# EasyEDA schematic Pressure Sensor2.json

## Sheets
1 Sheet_2: TITLE: Top Layer, Packing Machine; REV: 1.0; Date: 2022-11-06; Sheet: 1/1; Drawn By: RDickens; Company: Roy Dickens
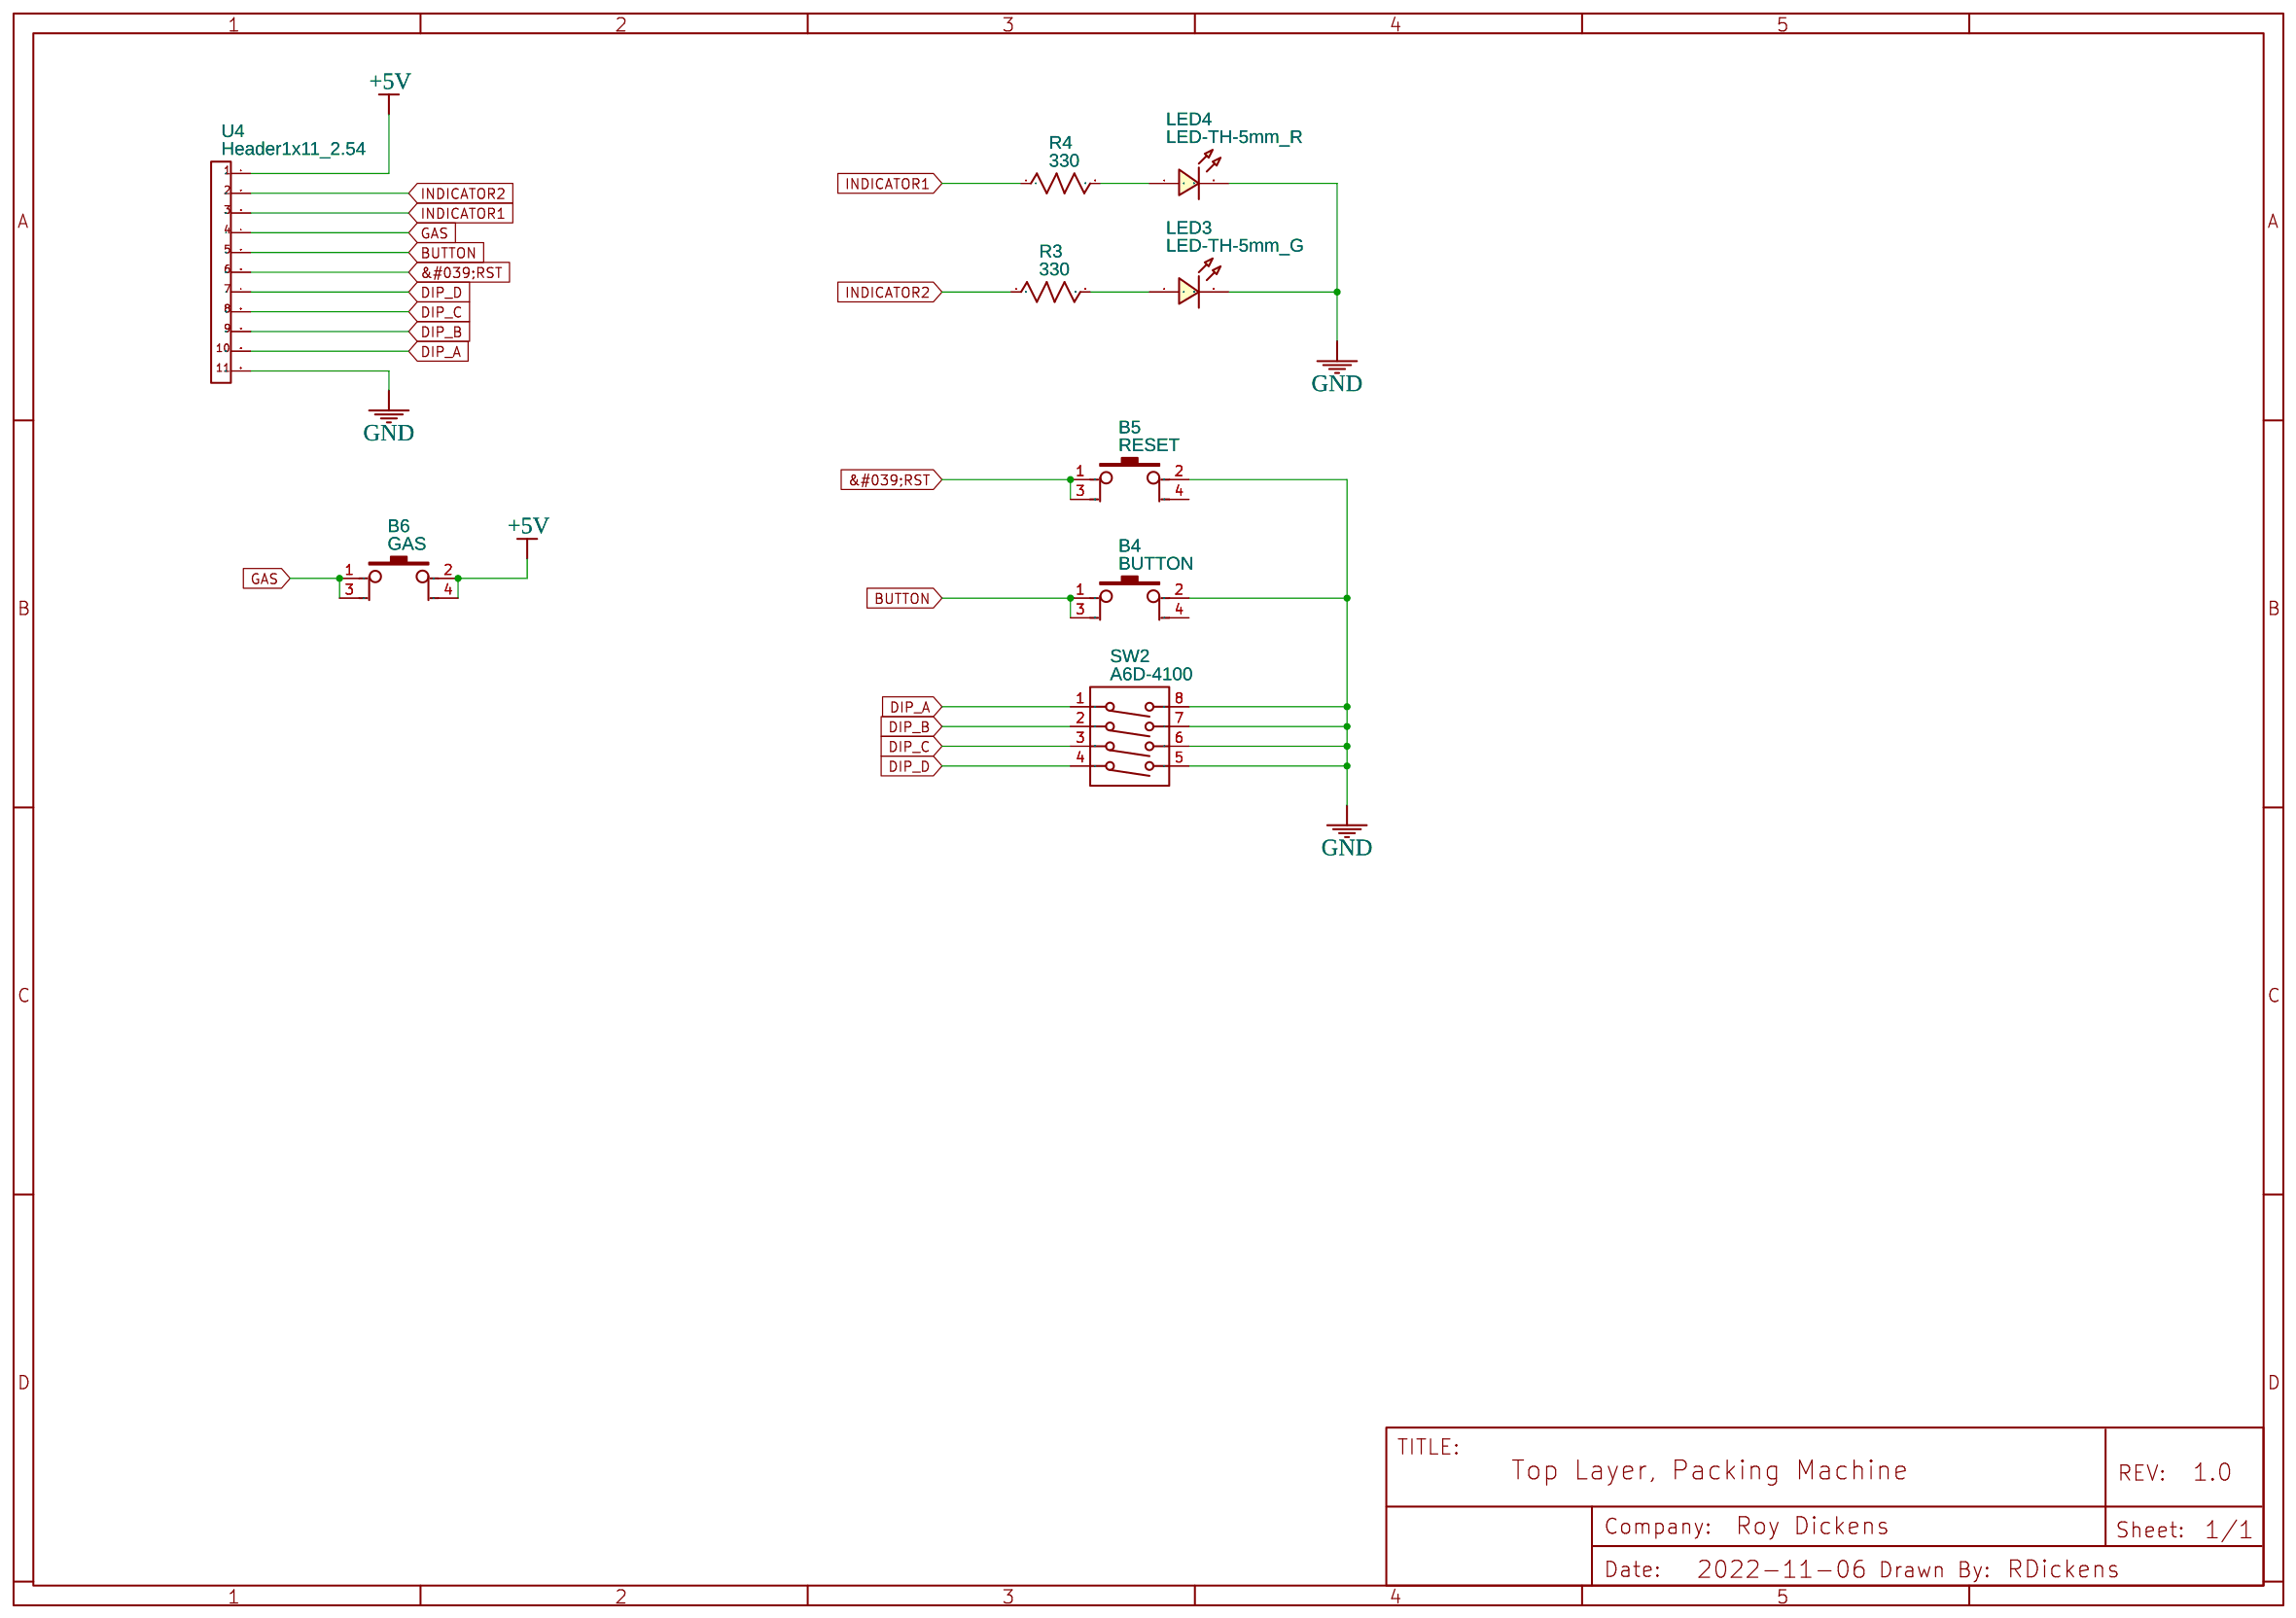
[diagram p0: Sheet_2]
2 Sheet_3: TITLE: Middle Layer, Packing Machine
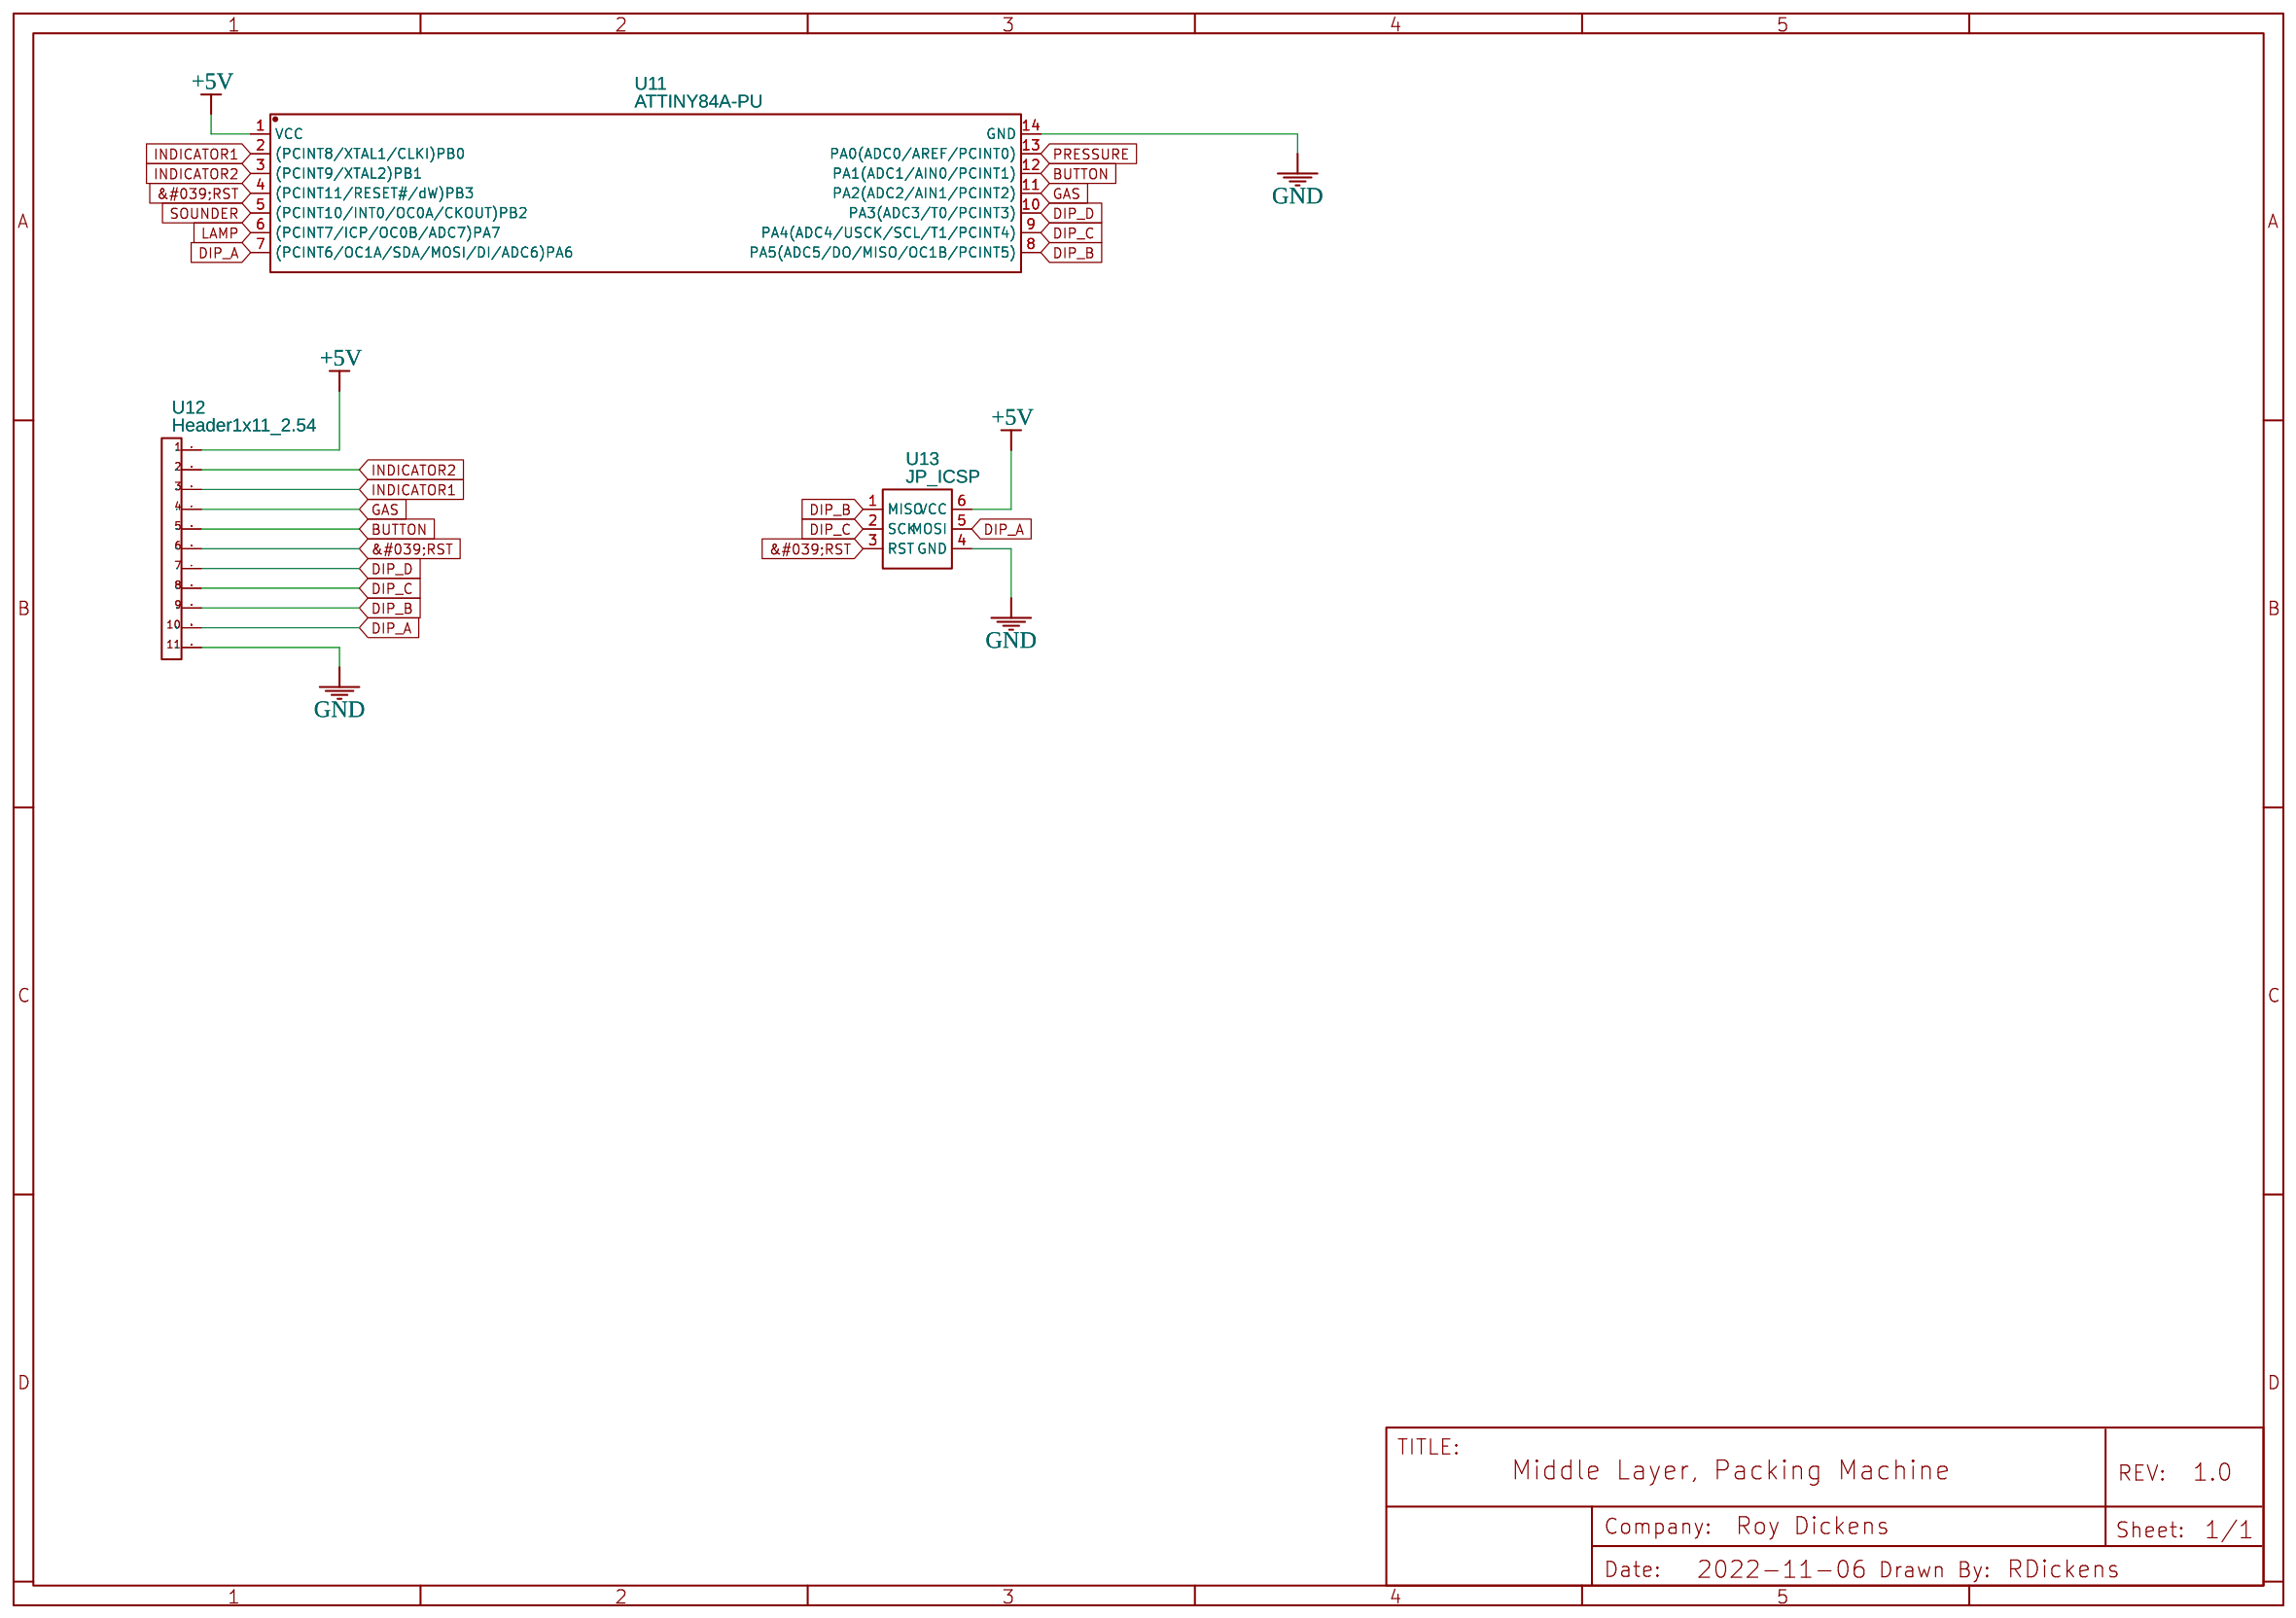
[diagram p1: Sheet_3]
3 Sheet_4: TITLE: Bottom Layer, Packing Machine
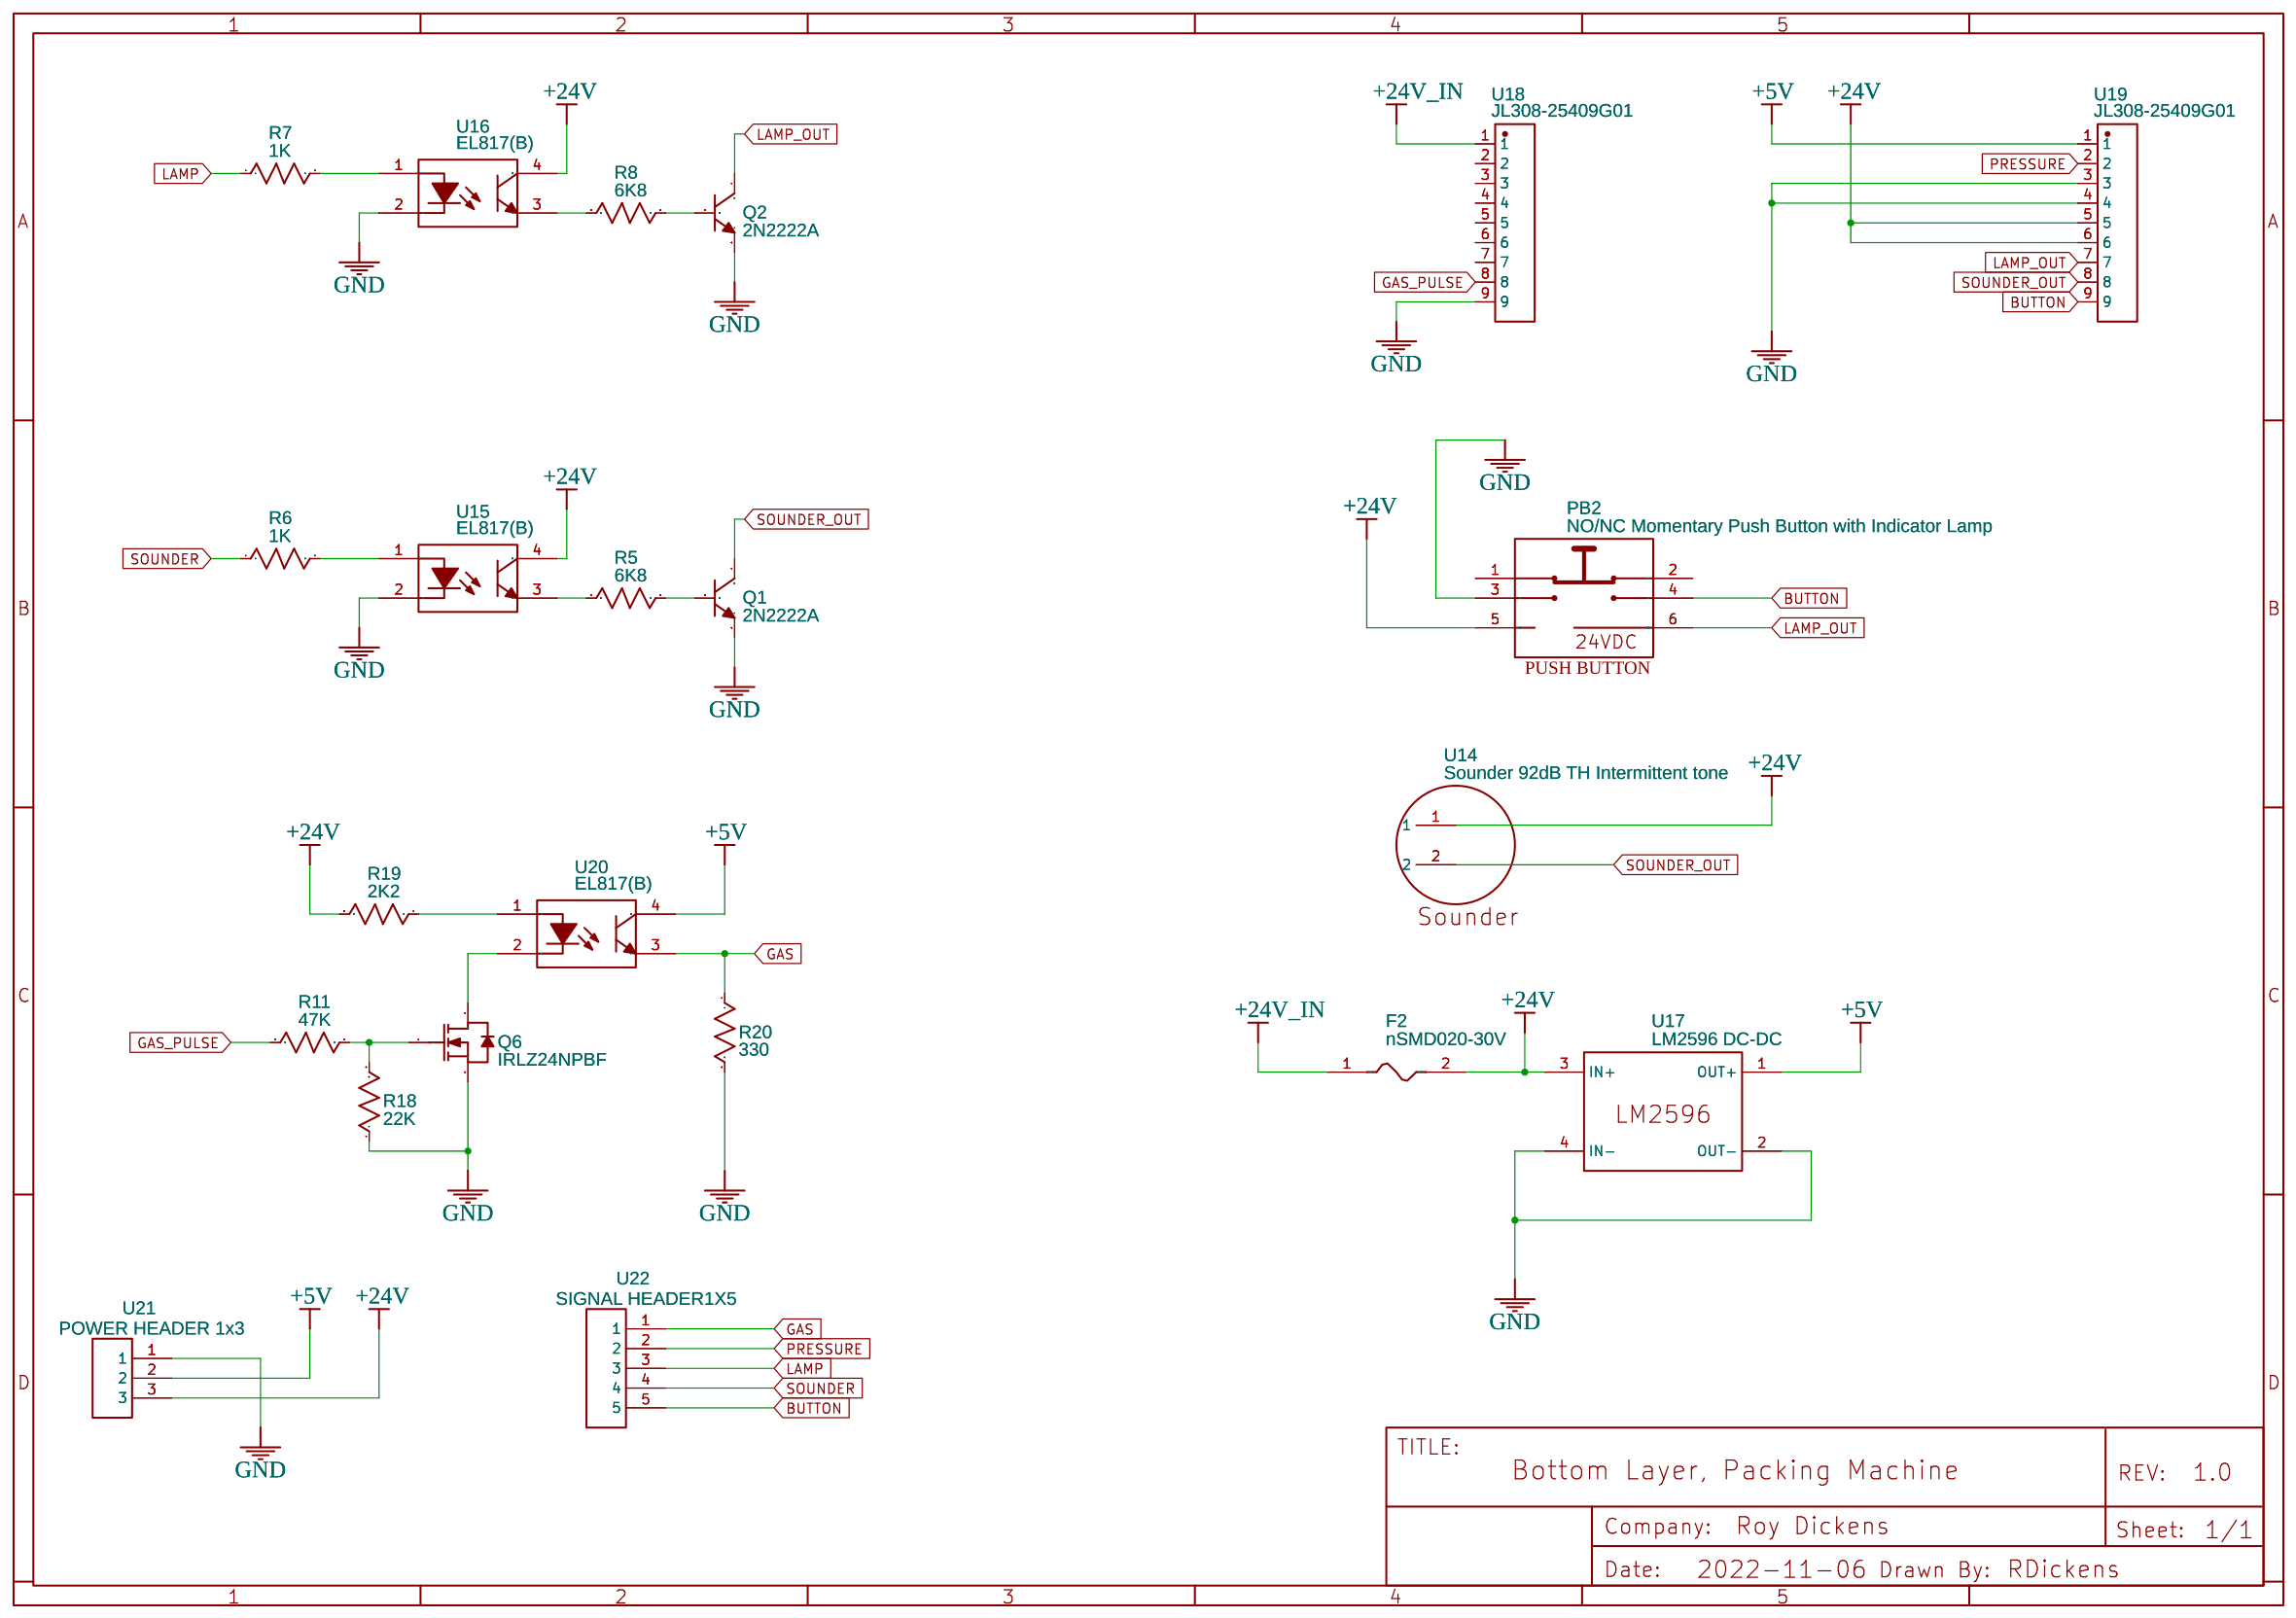
[diagram p2: Sheet_4]

## Parts
sheet Sheet_2
B4  BUTTON  [PUSHBUTTON]
B5  RESET  [PUSHBUTTON]
B6  GAS  [PUSHBUTTON]
LED3  LED-TH-5mm_G  [LED-TH_BD5.0_RED]
LED4  LED-TH-5mm_R  [LED-TH_BD5.0_RED]
R3  330  [R0603]
R4  330  [R0603]
SW2  A6D-4100  [SW-TH_8P-L12.2-W6.6-P2.54-LS7.62-BL]
U4  Header1x11_2.54  [HEADER1X11_2.54]
sheet Sheet_3
U11  ATTINY84A-PU  [DIP-14_L19.2-W6.6-P2.54-LS10.9-BL]
U12  Header1x11_2.54  [HEADER1X11_2.54]
U13  JP_ICSP  [JP_ICSP]
sheet Sheet_4
F2  nSMD020-30V  [F1206]
PB2  NO/NC Momentary Push Button with Indicator Lamp
Q1  2N2222A  [TO-92-3_L4.8-W3.7-P2.54-R]
Q2  2N2222A  [TO-92-3_L4.8-W3.7-P2.54-R]
Q6  IRLZ24NPBF  [TO-220-3_L10.0-W4.5-P2.54-T]
R5  6K8  [R0603]
R6  1K  [R0603]
R7  1K  [R0603]
R8  6K8  [R0603]
R11  47K  [R0603]
R18  22K  [R0603]
R19  2K2  [R0603]
R20  330  [R0603]
U14  Sounder 92dB TH Intermittent tone
U15  EL817(B)  [DIP-4_L6.5-W4.6-P2.54-LS7.6-BL]
U16  EL817(B)  [DIP-4_L6.5-W4.6-P2.54-LS7.6-BL]
U17  LM2596 DC-DC  [LM2596]
U18  JL308-25409G01  [CONN-TH_9P-P2.54_JILN_JL308-25409G01]
U19  JL308-25409G01  [CONN-TH_9P-P2.54_JILN_JL308-25409G01]
U20  EL817(B)  [DIP-4_L6.5-W4.6-P2.54-LS7.6-BL]
U21  POWER HEADER 1x3  [PINHEADER1X3]
U22  SIGNAL HEADER1X5  [PINHEADER1X5N]

## Library data of the parts
B4-B6 = PUSHBUTTON: Manufacturer Part: K2-1109DF-F4SW-04; Contributor: NC North; Supplier Part: C2909685; Supplier: LCSC; Manufacturer: 韩国韩荣
LED3 LED4 = LED-TH-5mm_R: Manufacturer: EVERLIGHT(台湾亿光); Manufacturer Part: 333-2SURD/S530-A3; Supplier Part: C87271; Supplier: LCSC; Contributor: LCEDA_Lib
R3 R4 = R_0603_US: Supplier Part: C713986; Supplier: LCSC; Contributor: LCEDA_Lib; Manufacturer Part: MF1/4W-330Ω±1%T52; Manufacturer: Huaxing Mechanical-Elec.
SW2 = A6D-4100: Supplier: LCSC; Supplier Part: C3313543; Manufacturer: OMRON(欧姆龙); link: https://atta.szlcsc.comnull; Contributor: lcsc
U4 U12 = Header1x11_2.54: Contributor: yabb777
U11 = ATTINY84A-PU: Supplier: LCSC; Manufacturer: MICROCHIP; Contributor: LCSC; Supplier Part: C145560; JLCPCB Part Class: Extended Part
U13 = JP_ICSP: Manufacturer: JILN; Manufacturer Part: 321006SG0ABK00A01; Supplier Part: C601936; Supplier: LCSC; Contributor: geotom
F2 = nSMD020-30V: Supplier: LCSC; Manufacturer: TECHFUSE; Supplier Part: C69680; JLCPCB Part Class: Extended Part
PB2 = NO/NC Momentary Push Button with Indicator Lamp: Manufacturer: Allied Electronics; Contributor: pretender42
Q1 Q2 = 2N2222A: Supplier: LCSC; Supplier Part: C358533; Manufacturer: Foshan Blue Rocket Elec; Contributor: LCSC; JLCPCB Part Class: Extended Part
Q6 = IRLZ24NPBF: Supplier: LCSC; Manufacturer: IR; Supplier Part: C11733; JLCPCB Part Class: Extended Part
R5-R8 R20 = R_0603_US: Supplier Part: C119314; Supplier: LCSC; Contributor: LCEDA_Lib; Manufacturer: Chian Chia Elec
R11 R18 = R_0603_US: Supplier Part: C714023; Supplier: LCSC; Contributor: LCEDA_Lib; Manufacturer Part: MF1/4W-24KΩ±1%T52; Manufacturer: Huaxing Mechanical-Elec.
R19 = R_0603_US: Supplier Part: C714002; Supplier: LCSC; Contributor: LCEDA_Lib; Manufacturer Part: MF1/4W-2.2KΩ±1%T52; Manufacturer: Huaxing Mechanical-Elec.
U14 = Sounder 92dB TH Intermittent tone: Manufacturer: Sonitron; Supplier: RS-Online; Supplier Part: 172-7560; Contributor: Coullboy
U15 U16 U20 = EL817(B): Supplier: LCSC; Supplier Part: C4749156; Manufacturer: EVERLIGHT(台湾亿光); Contributor: lcsc
U17 = LM2596 DC-DC: Contributor: allvex
U18 U19 = JL308-25409G01: Supplier: LCSC; Supplier Part: C99418; Manufacturer: Dongguan Guangzhu Industrial; Contributor: LCSC
U21 = PINHEADER1X3: Manufacturer Part: Pin_Header_2; Contributor: Wetronics
U22 = PINHEADER1X5: Supplier Part: undefined; Contributor: kbrunton

## Nets
+5V: B6.2(3) B6.4 U4.1 U11.1(VCC) U12.1 U13.6(VCC) U17.1(OUT+) U19.1 U20.4(C) U21.2
+24V: F2.2 PB2.5(LED) R19.2 U14.1 U15.4(C) U16.4(C) U17.3(IN+) U19.5 U19.6 U21.3
+24V_IN: F2.1 U18.1
GND: B4.2(3) B5.2(3) LED3.2 LED4.2 PB2.3(NO) Q1.3(E) Q2.3(E) Q6.3(S) R18.1 R20.2 SW2.5 SW2.6 SW2.7 SW2.8 U4.11 U11.14(GND) U12.11 U13.4(GND) U15.2(C) U16.2(C) U17.2(OUT-) U17.4(IN-) U18.9 U19.3 U19.4 U21.1
&#039;RST: B5.1 B5.3 U4.6 U11.4((PCINT11/RESET#/dW)PB3) U12.6 U13.3(RST)
BUTTON: B4.1 B4.3 PB2.4(NO) U4.5 U11.12(PA1(ADC1/AIN0/PCINT1)) U12.5 U19.9 U22.5
DIP_A: SW2.1 U4.10 U11.7((PCINT6/OC1A/SDA/MOSI/DI/ADC6)PA6) U12.10 U13.5(MOSI)
DIP_B: SW2.2 U4.9 U11.8(PA5(ADC5/DO/MISO/OC1B/PCINT5)) U12.9 U13.1(MISO)
DIP_C: SW2.3 U4.8 U11.9(PA4(ADC4/USCK/SCL/T1/PCINT4)) U12.8 U13.2(SCK)
DIP_D: SW2.4 U4.7 U11.10(PA3(ADC3/T0/PCINT3)) U12.7
GAS: B6.1 B6.3 R20.1 U4.4 U11.11(PA2(ADC2/AIN1/PCINT2)) U12.4 U20.3(E) U22.1
GAS_PULSE: R11.1 U18.8
INDICATOR1: R4.1 U4.3 U11.2((PCINT8/XTAL1/CLKI)PB0) U12.3
INDICATOR2: R3.1 U4.2 U11.3((PCINT9/XTAL2)PB1) U12.2
LAMP: R7.1 U11.6((PCINT7/ICP/OC0B/ADC7)PA7) U22.3
LAMP_OUT: PB2.6(LED) Q2.1(C) U19.7
PRESSURE: U11.13(PA0(ADC0/AREF/PCINT0)) U19.2 U22.2
SOUNDER: R6.1 U11.5((PCINT10/INT0/OC0A/CKOUT)PB2) U22.4
SOUNDER_OUT: Q1.1(C) U14.2 U19.8
Net-(LED3-1): LED3.1 R3.2
Net-(LED4-1): LED4.1 R4.2
Net-(Q1-2): Q1.2(B) R5.1
Net-(Q2-2): Q2.2(B) R8.1
Net-(Q6-1): Q6.1(G) R11.2 R18.2
Net-(Q6-2): Q6.2(D) U20.2(C)
Net-(R5-2): R5.2 U15.3(E)
Net-(R6-2): R6.2 U15.1(A)
Net-(R7-2): R7.2 U16.1(A)
Net-(R8-2): R8.2 U16.3(E)
Net-(R19-1): R19.1 U20.1(A)

Not connected (* = marked no-connect by the designer): B4 4; B5 4; PB2 1(NC) 2(NC); U18 2 3 4 5 6 7
